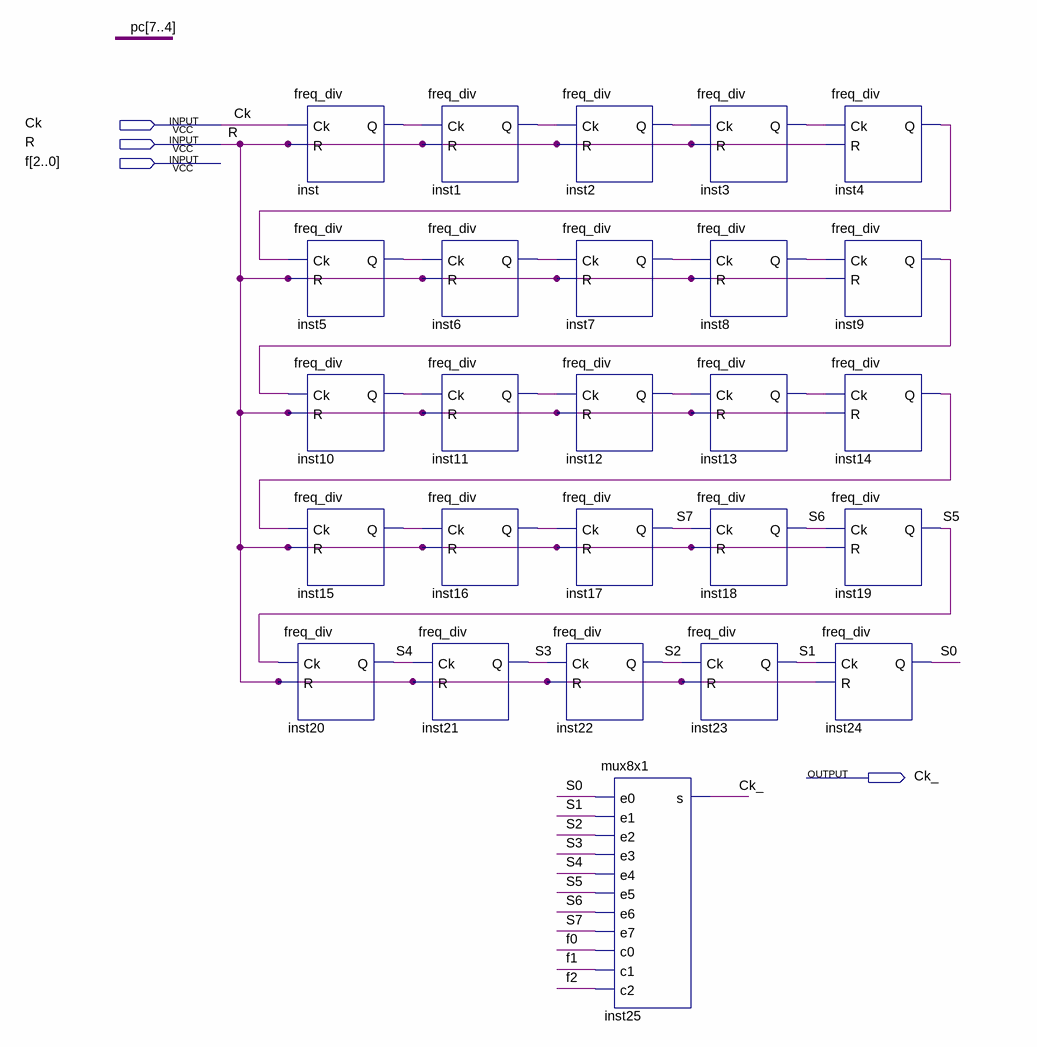
[diagram p0: schematic sheet]
// Quartus schematic freq_div25_select.bdf as structural Verilog: 26 symbols, 4 pins
module freq_div25_select (
  input  Ck,
  input  R,
  input  [2:0] f,
  output Ck_
);

  wire inst1_q, inst2_q, inst3_q, inst4_q, inst5_q, inst6_q, inst7_q, inst8_q, inst9_q, inst10_q, inst11_q,
       inst12_q, inst13_q, inst14_q, inst15_q, inst16_q, inst_q, S0, S1, S2, S3, S4, S5, S6, S7;

  freq_div inst (.Ck(Ck), .R(R), .Q(inst_q));
  freq_div inst5 (.Ck(inst4_q), .R(R), .Q(inst5_q));
  freq_div inst10 (.Ck(inst9_q), .R(R), .Q(inst10_q));
  freq_div inst15 (.Ck(inst14_q), .R(R), .Q(inst15_q));
  freq_div inst20 (.Ck(S5), .R(R), .Q(S4));
  freq_div inst1 (.Ck(inst_q), .R(R), .Q(inst1_q));
  freq_div inst6 (.Ck(inst5_q), .R(R), .Q(inst6_q));
  freq_div inst11 (.Ck(inst10_q), .R(R), .Q(inst11_q));
  freq_div inst16 (.Ck(inst15_q), .R(R), .Q(inst16_q));
  freq_div inst21 (.Ck(S4), .R(R), .Q(S3));
  freq_div inst2 (.Ck(inst1_q), .R(R), .Q(inst2_q));
  freq_div inst7 (.Ck(inst6_q), .R(R), .Q(inst7_q));
  freq_div inst12 (.Ck(inst11_q), .R(R), .Q(inst12_q));
  freq_div inst17 (.Ck(inst16_q), .R(R), .Q(S7));
  freq_div inst22 (.Ck(S3), .R(R), .Q(S2));
  mux8x1 inst25 (
    .e0(S0), .e1(S1), .e2(S2), .e3(S3), .e4(S4), .e5(S5), .e6(S6), .e7(S7), .c0(f[0]), .c1(f[1]), .c2(f[2]),
    .s(Ck_));
  freq_div inst3 (.Ck(inst2_q), .R(R), .Q(inst3_q));
  freq_div inst8 (.Ck(inst7_q), .R(R), .Q(inst8_q));
  freq_div inst13 (.Ck(inst12_q), .R(R), .Q(inst13_q));
  freq_div inst18 (.Ck(S7), .R(R), .Q(S6));
  freq_div inst23 (.Ck(S2), .R(R), .Q(S1));
  freq_div inst4 (.Ck(inst3_q), .R(R), .Q(inst4_q));
  freq_div inst9 (.Ck(inst8_q), .R(R), .Q(inst9_q));
  freq_div inst14 (.Ck(inst13_q), .R(R), .Q(inst14_q));
  freq_div inst19 (.Ck(S6), .R(R), .Q(S5));
  freq_div inst24 (.Ck(S1), .R(R), .Q(S0));
endmodule
